# EAGLE schematic Schematic (EAGLE 9.6.2)
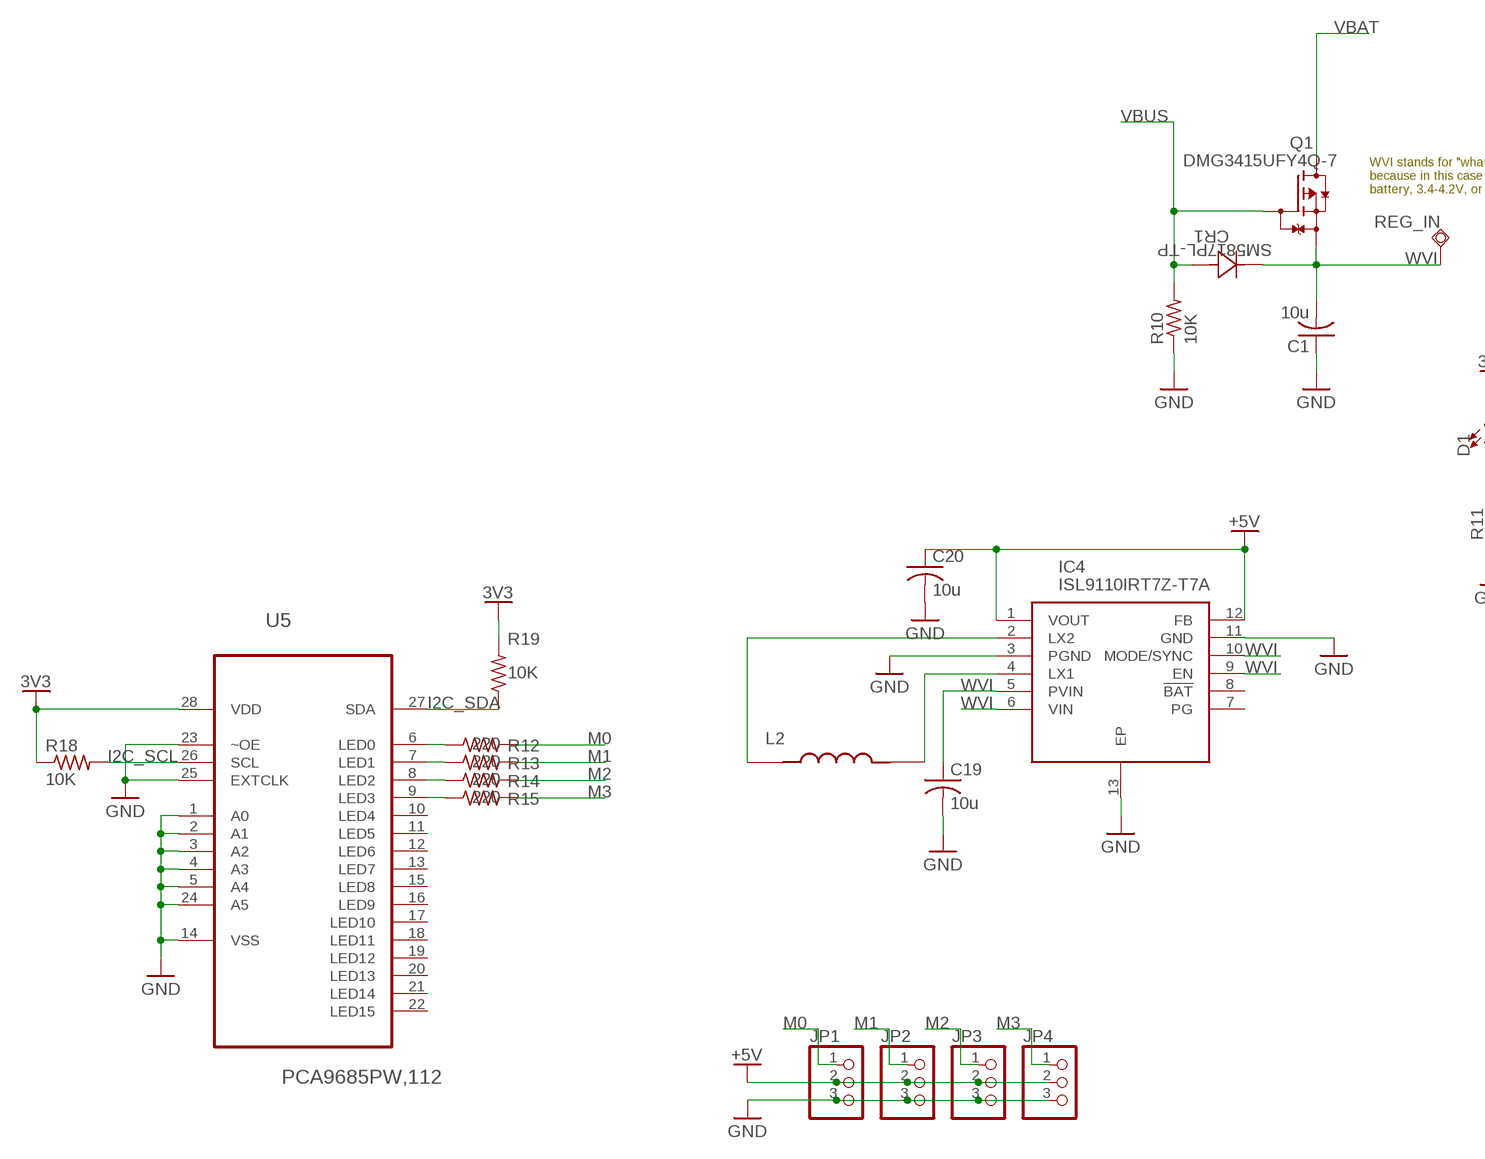
[diagram p0: schematic, sheet 1, part 1 of 2]
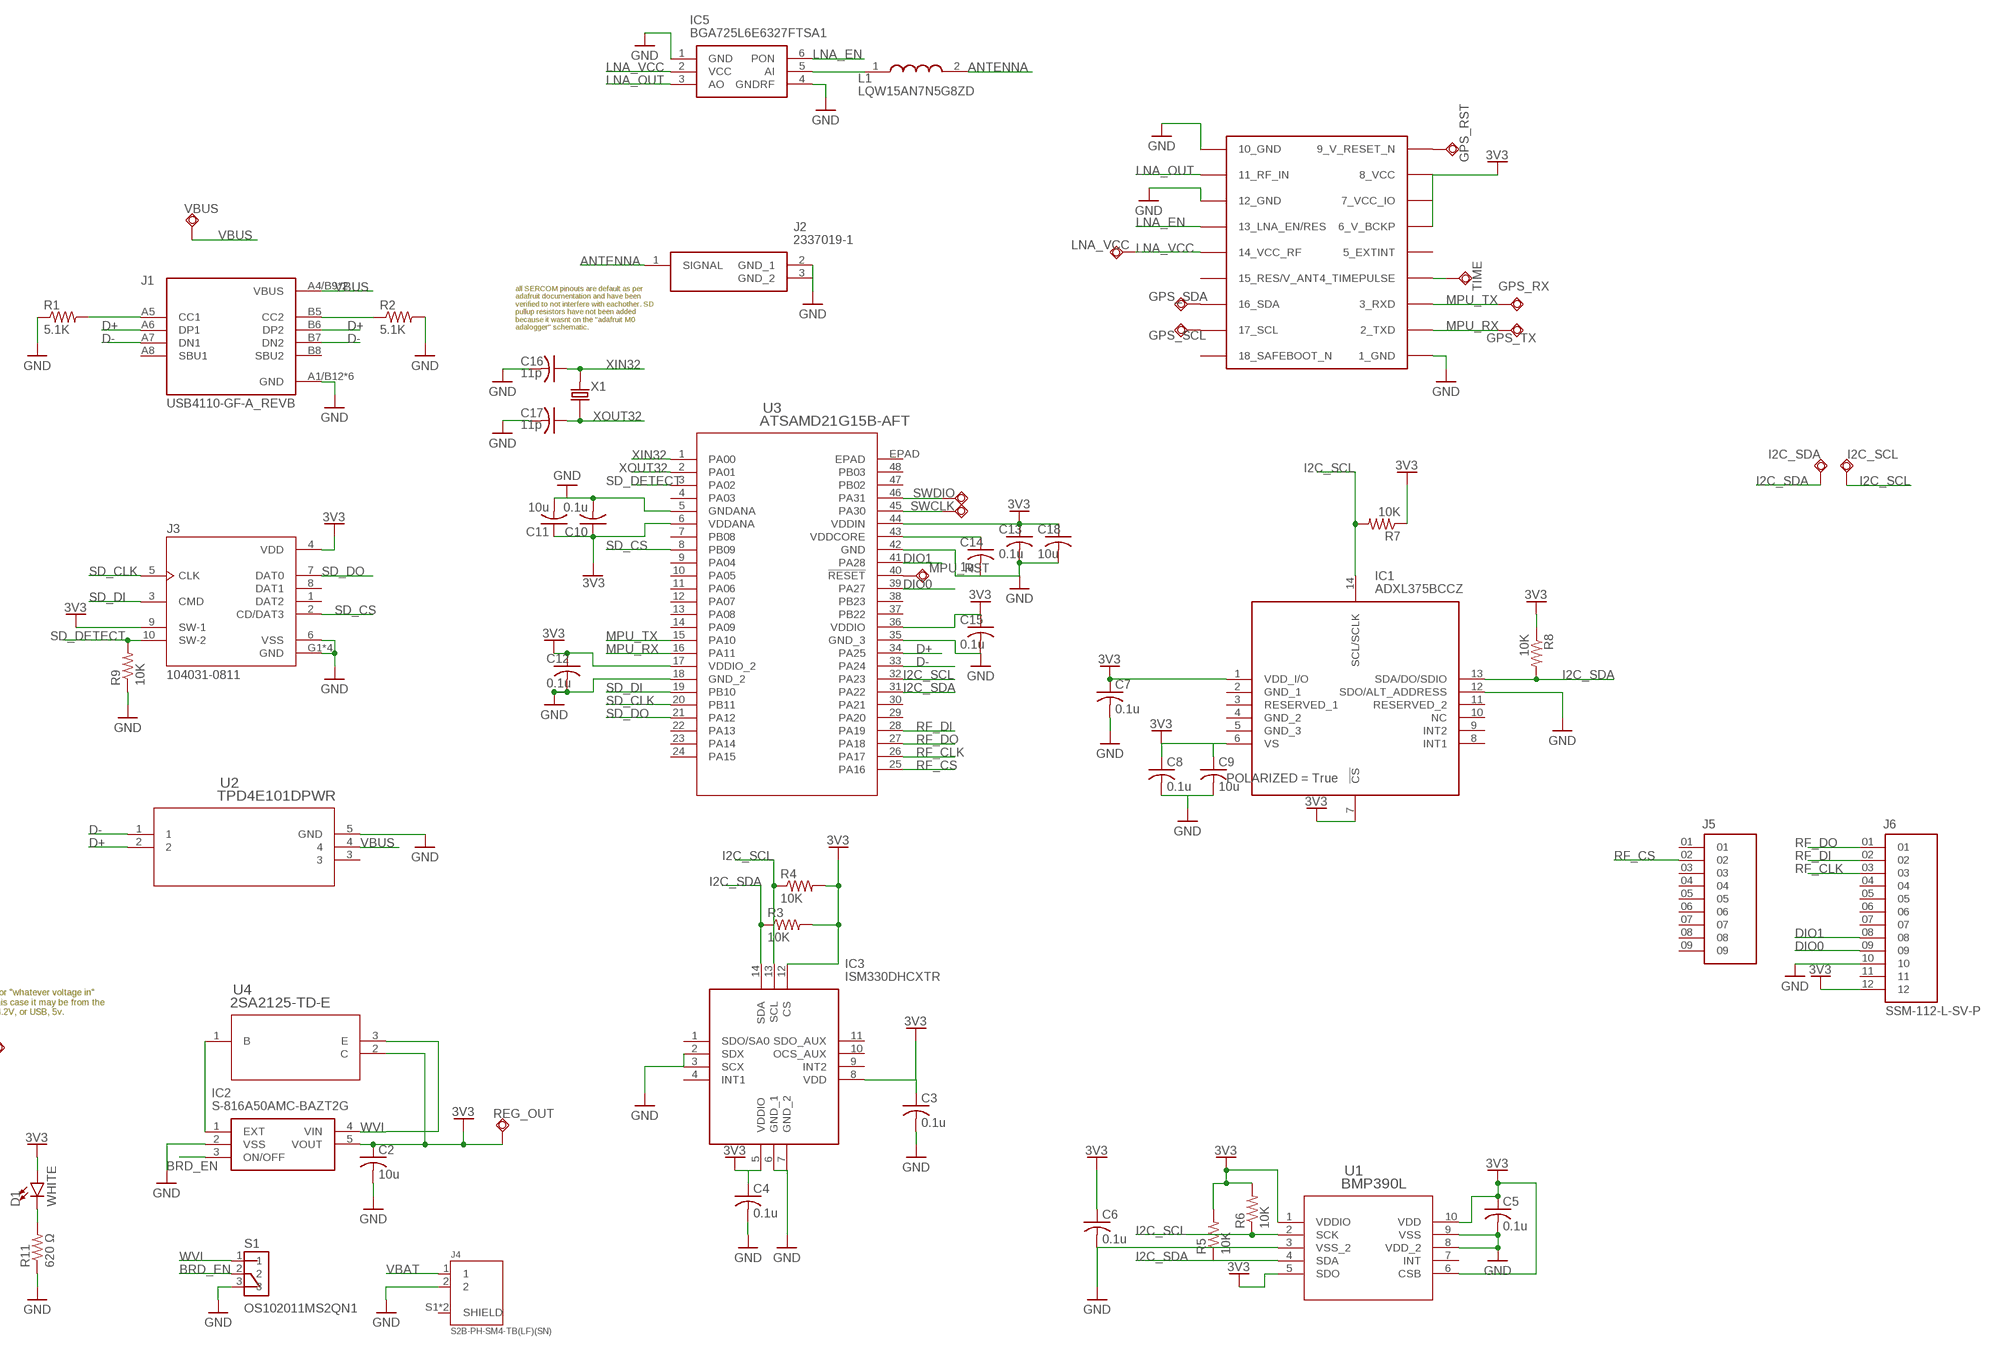
[diagram p1: schematic, sheet 1, part 2 of 2]

## Parts
C1  10u  C-USC0805  [C0805]
C2  10u  C-USC0805  [C0805]
C3  0.1u  C-USC0805  [C0805]
C4  0.1u  C-USC0805  [C0805]
C5  0.1u  C-USC0805  [C0805]
C6  0.1u  C-USC0805  [C0805]
C7  0.1u  C-USC0805  [C0805]
C8  0.1u  C-USC0805  [C0805]
C9  10u  C-USC0805  [C0805]
C10  0.1u  C-USC0603  [C0603]
C11  10u  C-USC0805  [C0805]
C12  0.1u  C-USC0603  [C0603]
C13  0.1u  C-USC0603  [C0603]
C14  1u  C-USC0603  [C0603]
C15  0.1u  C-USC0603  [C0603]
C16  11p  C-US_CHIP-0402(1005-METRIC)  [CAPC1005X60]
C17  11p  C-US_CHIP-0402(1005-METRIC)  [CAPC1005X60]
C18  10u  C-USC0603  [C0603]
C19  10u  C-USC0805K  [C0805K]
C20  10u  C-USC0805K  [C0805K]
CR1  SM5817PL-TP  [CR_5817PL-TP_MCC]
D1  WHITE  LED-WHITE0603  [LED-0603]
GPS_RST  TPSQTP20SQ  [TP20SQ]
GPS_RX  TPSQTP20SQ  [TP20SQ]
GPS_SCL  TPSQTP20SQ  [TP20SQ]
GPS_SDA  TPSQTP20SQ  [TP20SQ]
GPS_TX  TPSQTP20SQ  [TP20SQ]
I2C_SCL  TPSQTP20SQ  [TP20SQ]
I2C_SDA  TPSQTP20SQ  [TP20SQ]
IC1  ADXL375BCCZ  [CC-14-1]
IC2  S-816A50AMC-BAZT2G  [SOT95P275X130-5N]
IC3  ISM330DHCXTR  [LGA-14(2.5X3X0.86)]
IC4  ISL9110IRT7Z-T7A  [SON40P300X300X75-13N]
IC5  BGA725L6E6327FTSA1  [BGS12SN6E6327XTSA1]
J1  USB4110-GF-A_REVB  [GCT_USB4110-GF-A_REVB]
J2  2337019-1  [23370191]
J3  104031-0811  [MOLEX_104031-0811]
J4  S2B-PH-SM4-TB(LF)(SN)  [JST_S2B-PH-SM4-TB(LF)(SN)]
J5  SSM-109-L-SV  [SAMTEC_SSM-109-L-SV]
J6  SSM-112-L-SV-P  [SAMTEC_SSM-112-L-SV-P]
JP1  PINHD-1X3  [1X03]
JP2  PINHD-1X3  [1X03]
JP3  PINHD-1X3  [1X03]
JP4  PINHD-1X3  [1X03]
L1  LQW15AN7N5G8ZD  [LQW15CNR20J00B]
L2  LQH43PN2R2M26L  [IND_LQH43PN2R2M26L]
LNA_VCC  TPSQTP20SQ  [TP20SQ]
MPU_RST  TPSQTP20SQ  [TP20SQ]
Q1  DMG3415UFY4Q-7  [TRANS_DMG3415UFY4Q-7]
R1  5.1K  R-US_M0805  [M0805]
R2  5.1K  R-US_M0805  [M0805]
R3  10K  R-US_M0805  [M0805]
R4  10K  R-US_M0805  [M0805]
R5  10K  R-US_M0805  [M0805]
R6  10K  R-US_M0805  [M0805]
R7  10K  R-US_M0805  [M0805]
R8  10K  R-US_M0805  [M0805]
R9  10K  R-US_M0805  [M0805]
R10  10K  R-US_M0805  [M0805]
R11  620 Ω  R-US_R0402  [R0402]
R12  220  R-US_R0805  [R0805]
R13  220  R-US_R0805  [R0805]
R14  220  R-US_R0805  [R0805]
R15  220  R-US_R0805  [R0805]
R18  10K  R-US_R0805  [R0805]
R19  10K  R-US_R0805  [R0805]
REG_IN  TPSQTP20SQ  [TP20SQ]
REG_OUT  TPSQTP20SQ  [TP20SQ]
S1  OS102011MS2QN1  [SW_OS102011MS2QN1]
SWCLK  TPSQTP20SQ  [TP20SQ]
SWDIO  TPSQTP20SQ  [TP20SQ]
TIME  TPSQTP20SQ  [TP20SQ]
U1  BMP390L  [BMP390L_BOS]
U2  TPD4E101DPWR  [DPW4]
U3  ATSAMD21G15B-AFT  [TQFP48_7X7MC_MCH]
U4  2SA2125-TD-E  [PCP-3_2P5X4P5_ONS]
U5  PCA9685PW,112  [SOP65P640X110-28N]
U$1  MAX-M8  [MAX-M8]
VBUS  TPSQTP20SQ  [TP20SQ]
X1  ECS-.327-7-34B-TR  [XTAL_ECS-.327-7-34B-TR]

## Nets
3V3: C2.1 C3.1 C4.1 C5.1 C6.1 C7.1 C8.1 C9.1 C10.1 C11.1 C12.1 C13.1 C15.1 C18.1 D1.A IC1.1(VDD_I/O) IC1.6(VS) IC1.7(!CS) IC2.5(VOUT) IC3.5(VDDIO) IC3.8(VDD) IC3.12(CS) J3.4(VDD) J3.9(SW-1) J6.12 R3.2 R4.2 R5.2 R6.2 R7.1 R8.1 R18.1 R19.2 REG_OUT.TP U1.1(VDDIO) U1.5(SDO) U1.6(CSB) U1.10(VDD) U3.6(VDDANA) U3.17(VDDIO_2) U3.36(VDDIO) U3.44(VDDIN) U4.2(C) U5.28(VDD) U$1.6_V_BCKP U$1.7_VCC_IO U$1.8_VCC
+5V: C20.1 IC4.1(VOUT) IC4.12(FB) JP1.2 JP2.2 JP3.2 JP4.2
ANTENNA: J2.1(SIGNAL) L1.2
BRD_EN: IC2.3(ON/OFF) S1.2
D+: J1.A6(DP1) J1.B6(DP2) U2.2 U3.34(PA25)
D-: J1.A7(DN1) J1.B7(DN2) U2.1 U3.33(PA24)
DIO0: J6.09 U3.39(PA27)
DIO1: J6.08 U3.41(PA28)
GND: C1.1 C2.2 C3.2 C4.2 C5.2 C6.2 C7.2 C8.2 C9.2 C10.2 C11.2 C12.2 C13.2 C14.2 C15.2 C16.2 C17.2 C18.2 C19.2 C20.2 IC1.12(SDO/ALT_ADDRESS) IC2.2(VSS) IC3.2(SDX) IC3.3(SCX) IC3.6(GND_1) IC3.7(GND_2) IC4.3(PGND) IC4.11(GND) IC4.13(EP) IC5.1(GND) IC5.4(GNDRF) J1.A1/B12(GND) J1.B1/A12(GND) J1.S1(GND) J1.S2(GND) J1.S3(GND) J1.S4(GND) J2.2(GND_1) J2.3(GND_2) J3.6(VSS) J3.G1(GND) J3.G2(GND) J3.G3(GND) J3.G4(GND) J4.2 J6.10 JP1.3 JP2.3 JP3.3 JP4.3 R1.1 R2.2 R9.1 R10.1 R11.1 S1.3 U1.3(VSS_2) U1.8(VDD_2) U1.9(VSS) U2.5(GND) U3.5(GNDANA) U3.18(GND_2) U3.35(GND_3) U3.42(GND) U5.1(A0) U5.2(A1) U5.3(A2) U5.4(A3) U5.5(A4) U5.14(VSS) U5.23(~OE) U5.24(A5) U5.25(EXTCLK) U$1.1_GND U$1.10_GND U$1.12_GND
I2C_SCL: I2C_SCL.TP IC1.14(SCL/SCLK) IC3.13(SCL) R4.1 R6.1 R7.2 R18.2 U1.2(SCK) U3.32(PA23) U5.26(SCL)
I2C_SDA: I2C_SDA.TP IC1.13(SDA/DO/SDIO) IC3.14(SDA) R3.1 R5.1 R8.2 R19.1 U1.4(SDA) U3.31(PA22) U5.27(SDA)
LNA_EN: IC5.6(PON) U$1.13_LNA_EN(13_LNA_EN/RES)
LNA_OUT: IC5.3(AO) U$1.11_RF_IN
LNA_VCC: IC5.2(VCC) LNA_VCC.TP U$1.14_VCC_RF
M0: JP1.1 R12.2
M1: JP2.1 R13.2
M2: JP3.1 R14.2
M3: JP4.1 R15.2
MPU_RX: GPS_TX.TP U3.16(PA11) U$1.2_TXD
MPU_TX: GPS_RX.TP U3.15(PA10) U$1.3_RXD
N$1: J1.A5(CC1) R1.2
N$2: J1.B5(CC2) R2.1
N$3: MPU_RST.TP U3.40(!RESET)
N$4: IC5.5(AI) L1.1
N$5: TIME.TP U$1.4_TIMEPULSE
N$6: C14.1 U3.43(VDDCORE)
N$7: GPS_RST.TP U$1.9_RESET_N(9_V_RESET_N)
N$8: IC2.1(EXT) U4.1(B)
N$9: GPS_SDA.TP U$1.16_SDA
N$10: GPS_SCL.TP U$1.17_SCL
N$11: SWCLK.TP U3.45(PA30)
N$12: SWDIO.TP U3.46(PA31)
N$13: D1.C R11.2
N$14: IC4.4(LX1) L2.2
N$15: IC4.2(LX2) L2.1
N$16: R12.1 U5.6(LED0)
N$17: R13.1 U5.7(LED1)
N$18: R14.1 U5.8(LED2)
N$19: R15.1 U5.9(LED3)
RF_CLK: J6.03 U3.26(PA17)
RF_CS: J5.02 U3.25(PA16)
RF_DI: J6.02 U3.28(PA19)
RF_DO: J6.01 U3.27(PA18)
SD_CLK: J3.5(CLK) U3.20(PB11)
SD_CS: J3.2(CD/DAT3) U3.8(PB09)
SD_DETECT: J3.10(SW-2) R9.2 U3.3(PA02)
SD_DI: J3.3(CMD) U3.19(PB10)
SD_DO: J3.7(DAT0) U3.21(PA12)
VBAT: J4.1 Q1.3(D)
VBUS: CR1.2 J1.A4/B9(VBUS) J1.B4/A9(VBUS) Q1.1(G) R10.2 U2.4 VBUS.TP
WVI: C1.2 C19.1 CR1.1 IC2.4(VIN) IC4.5(PVIN) IC4.6(VIN) IC4.9(EN) IC4.10(MODE/SYNC) Q1.2(S) REG_IN.TP S1.1 U4.3(E)
XIN32: C16.1 U3.1(PA00) X1.2
XOUT32: C17.1 U3.2(PA01) X1.1
Unconnected: IC1.2(GND_1) IC1.3(RESERVED_1) IC1.4(GND_2) IC1.5(GND_3) IC1.8(INT1) IC1.9(INT2) IC1.10(NC) IC1.11(RESERVED_2) IC3.1(SDO/SA0) IC3.4(INT1) IC3.9(INT2) IC3.10(OCS_AUX) IC3.11(SDO_AUX) IC4.7(PG) IC4.8(!BAT) J1.A8(SBU1) J1.B8(SBU2) J3.1(DAT2) J3.8(DAT1) J4.S1(SHIELD) J4.S2(SHIELD) J5.01 J5.03 J5.04 J5.05 J5.06 J5.07 J5.08 J5.09 J6.04 J6.05 J6.06 J6.07 J6.11 U1.7(INT) U2.3 U3.4(PA03) U3.7(PB08) U3.9(PA04) U3.10(PA05) U3.11(PA06) U3.12(PA07) U3.13(PA08) U3.14(PA09) U3.22(PA13) U3.23(PA14) U3.24(PA15) U3.29(PA20) U3.30(PA21) U3.37(PB22) U3.38(PB23) U3.47(PB02) U3.48(PB03) U3.EPAD U5.10(LED4) U5.11(LED5) U5.12(LED6) U5.13(LED7) U5.15(LED8) U5.16(LED9) U5.17(LED10) U5.18(LED11) U5.19(LED12) U5.20(LED13) U5.21(LED14) U5.22(LED15) U$1.5_EXTINT U$1.15_V_ANT/RESERVED(15_RES/V_ANT) U$1.18_SAFEBOOT_N

## Notes on the sheet
- all SERCOM pinouts are default as per 
  adafruit documentation and have been 
  verified to not interfere with eachother. SD 
  pullup resistors have not been added 
  because it wasnt on the "adafruit M0 
  adalogger" schematic.
- WVI stands for "whatever voltage in"
  because in this case it may be from the 
  battery, 3.4-4.2V, or USB, 5v.

## Library data of the parts
C1-C8 C10-C15 C18-C20 = resistor:C-US: CAPACITOR, American symbol
C9 = resistor:C-US: CAPACITOR, American symbol; POLARIZED: True
C16 C17 = Capacitor:C-US: Capacitor - ANSI; CATEGORY: Capacitor
CR1 = SM5817PL-TP:SM5817PL-TP; COPYRIGHT: Copyright (C) 2022 Ultra Librarian. All rights reserved.; DIGI-KEY_PART_NUMBER_1: SM5817PL-TPMSTR-ND; DIGI-KEY_PART_NUMBER_2: SM5817PL-TPMSCT-ND; DIGI-KEY_PART_NUMBER_3: SM5817PL-TPMSDKR-ND; MANUFACTURER_PART_NUMBER: SM5817PL-TP; MFR_NAME: MCC
D1 = SparkFun-LED:LED-WHITE: White SMD LED Used in manufacturing several products at SparkFun. Packages: 0603 - Bright White SMD 0603 package[Product Link] <http://www.kingbrightusa.com/product.asp?catalog_name=LED&product_id=APT1608QWF/D> 1206 - Bright White SMD1206 package [Product Link] <http://www.kingbrightusa.com/product.asp?catalog_name=LED&product_id=APT3216QWF/D> 3014 - Super Bright SMD 3014 package [Datasheet] <http://www.lumileds.com/uploads/459/DS208-pdf> SparkFun Products: Blackberry Trackballer Breakout <https://www.sparkfun.com/products/13169> Digital SandBox <https://www.sparkfun.com/products/12651>; PROD_ID: DIO-09004
GPS_RST GPS_RX GPS_SCL GPS_SDA GPS_TX I2C_SCL I2C_SDA LNA_VCC MPU_RST REG_IN REG_OUT SWCLK SWDIO TIME VBUS = testpad:TPSQ: Test pad
IC1 = ADXL375BCCZ:ADXL375BCCZ: ADXL375BCCZ Analog Devices, 3-Axis Accelerometer, I2C, Serial-3 Wire, Serial-4 Wire, Serial-SPI, 14-Pin LGA Source: Datasheet; DESCRIPTION: ADXL375BCCZ Analog Devices, 3-Axis Accelerometer, I2C, Serial-3 Wire, Serial-4 Wire, Serial-SPI, 14-Pin LGA; HEIGHT: mm; MANUFACTURER_NAME: Analog Devices; MANUFACTURER_PART_NUMBER: ADXL375BCCZ; MOUSER_PART_NUMBER: 584-ADXL375BCCZ; MOUSER_PRICE-STOCK: https://www.mouser.co.uk/ProductDetail/Analog-Devices/ADXL375BCCZ?qs=S4ILP0tmc7Q%2Fd%2FHPWf9YpQ%3D%3D
IC2 = S-816A50AMC-BAZT2G:S-816A50AMC-BAZT2G: IC REG LINEAR 5V 1A SOT23-5 Source: Datasheet <https://componentsearchengine.com/Datasheets/1/S-816A50AMC-BAZT2G.pdf>; DESCRIPTION: IC REG LINEAR 5V 1A SOT23-5; HEIGHT: 1.3mm; MANUFACTURER_NAME: ABLIC Inc.; MANUFACTURER_PART_NUMBER: S-816A50AMC-BAZT2G; MOUSER_PART_NUMBER: 628-S-816A50AMC-BAZG; MOUSER_PRICE-STOCK: https://www.mouser.com/Search/Refine.aspx?Keyword=628-S-816A50AMC-BAZG
IC3 = ISM330DHCXTR:ISM330DHCXTR: IMUs - Inertial Measurement Units VFLGA2.5X3X.86 14L P.5 L.475X.25 Source: Datasheet <https://www.st.com/resource/en/datasheet/ism330dhcx.pdf>; DESCRIPTION: IMUs - Inertial Measurement Units VFLGA2.5X3X.86 14L P.5 L.475X.25; HEIGHT: mm; MANUFACTURER_NAME: STMicroelectronics; MANUFACTURER_PART_NUMBER: ISM330DHCXTR; MOUSER_PART_NUMBER: 511-ISM330DHCXTR; MOUSER_PRICE-STOCK: https://www.mouser.co.uk/ProductDetail/STMicroelectronics/ISM330DHCXTR?qs=%252B6g0mu59x7Jv2Xps2dM6Xw%3D%3D
IC4 = ISL9110IRT7Z-T7A:ISL9110IRT7Z-T7A: Switching Voltage Regulators 1 2A SINGLE IND BUCK BOOST 3 3V 12LD Source: Datasheet <https://datasheet.datasheetarchive.com/originals/distributors/Datasheets-SFU4/DSASF4000-1643.pdf>; DESCRIPTION: Switching Voltage Regulators 1 2A SINGLE IND BUCK BOOST 3 3V 12LD; HEIGHT: 0.75mm; MANUFACTURER_NAME: Renesas Electronics; MANUFACTURER_PART_NUMBER: ISL9110IRT7Z-T7A; MOUSER_PART_NUMBER: 968-ISL9110IRT7Z-T7A; MOUSER_PRICE-STOCK: https://www.mouser.co.uk/ProductDetail/Renesas-Intersil/ISL9110IRT7Z-T7A?qs=dAsayXGOMrujtMdmCjK0tg%3D%3D
IC5 = BGA725L6E6327FTSA1:BGA725L6E6327FTSA1: INFINEON - BGA725L6E6327FTSA1 - RF AMP, 20DB, 1.615GHZ, 3.6V, TSLP-6 Source: Datasheet <https://www.infineon.com/dgdl/Infineon-BGA725L6-DS-v02_00-en.pdf?fileId=db3a30433784a0400137ef9a4d341f23>; DESCRIPTION: INFINEON - BGA725L6E6327FTSA1 - RF AMP, 20DB, 1.615GHZ, 3.6V, TSLP-6; HEIGHT: mm; MANUFACTURER_NAME: Infineon; MANUFACTURER_PART_NUMBER: BGA725L6E6327FTSA1; MOUSER_PART_NUMBER: 726-BGA725L6E6327FTS; MOUSER_PRICE-STOCK: https://www.mouser.co.uk/ProductDetail/Infineon-Technologies/BGA725L6E6327FTSA1?qs=4MqXaUMeF57lT69yR2PUGQ%3D%3D
J1 = USB4110-GF-A_REVB:USB4110-GF-A_REVB; DESCRIPTION: USB-C (USB TYPE-C) USB 2.0 Receptacle Connector 24 (16+8 Dummy) Position Surface Mount, Right Angle; Through Hole; DIGI-KEY_PART_NUMBER: 2073-USB4110-GF-A-2-ND; MF: GCT; MP: USB4110-GF-A; PACKAGE: None; PURCHASE-URL: https://pricing.snapeda.com/search/part/USB4110-GF-A/?ref=eda
J2 = 2337019-1:2337019-1: RF Connectors / Coaxial Connectors MicroCoax receptacle UMCC Gen 1 Source: Datasheet <https://www.te.com/commerce/DocumentDelivery/DDEController?Action=showdoc&DocId=Customer DrawingC-2337019A3pdfEnglishENG_CD_C-2337019_A3.pdf2337019-1>; DESCRIPTION: RF Connectors / Coaxial Connectors MicroCoax receptacle UMCC Gen 1; HEIGHT: 1.4mm; MANUFACTURER_NAME: TE Connectivity; MANUFACTURER_PART_NUMBER: 2337019-1; MOUSER_PART_NUMBER: 571-2337019-1; MOUSER_PRICE-STOCK: https://www.mouser.co.uk/ProductDetail/TE-Connectivity/2337019-1?qs=l4Gc20tDgJIuN7nS9rJkJw%3D%3D
J3 = 104031-0811:104031-0811: 10 (8 + 2) Position Card Connector Secure Digital - microSD™ Surface Mount, Right Angle Gold; DESCRIPTION: 10 (8 + 2) Position Card Connector Secure Digital - microSD™ Surface Mount, Right Angle Gold; DIGI-KEY_PART_NUMBER: WM6357TR-ND; MF: Molex; MP: 1040310811; PACKAGE: None
J4 = S2B-PH-SM4-TB_LF__SN_:S2B-PH-SM4-TB(LF)(SN): PH Series 2 Position 2 mm Pitch Surface Mount Side Entry Shrouded Header; DESCRIPTION: Connector Header Surface Mount, Right Angle 2 position 0.079 (2.00mm); DIGI-KEY_PART_NUMBER: 455-1749-1-ND; MF: JST Sales; MP: S2B-PH-SM4-TB(LF)(SN); PACKAGE: None
J5 = SSM-109-L-SV:SSM-109-L-SV; DESCRIPTION: 9 Position Receptacle, Bottom Entry Connector 0.100 (2.54mm) Surface Mount Gold; DIGI-KEY_PART_NUMBER: 612-SSM-109-L-SV-BE-LC-TR-ND; MF: Samtec; MP: SSM-109-L-SV; PACKAGE: None; PURCHASE-URL: https://pricing.snapeda.com/search/part/SSM-109-L-SV/?ref=eda
J6 = SSM-112-L-SV-P:SSM-112-L-SV-P; DESCRIPTION: 12 Position Receptacle, Pass Through Connector 0.100 (2.54mm) Surface Mount Gold; DIGI-KEY_PART_NUMBER: SSM-112-L-SV-P-TR-ND; MF: Samtec; MP: SSM-112-L-SV-P; PACKAGE: None; PURCHASE-URL: https://pricing.snapeda.com/search/part/SSM-112-L-SV-P/?ref=eda
JP1-JP4 = pinhead:PINHD-1X3: PIN HEADER
L1 = LQW15AN7N5G8ZD:LQW15AN7N5G8ZD: LQW15AN_8Z Series Inductor 7.5nH +/-2% 0402 (1005) Source: Datasheet <https://componentsearchengine.com/Datasheets/1/LQW15AN7N5G8ZD.pdf>; DESCRIPTION: LQW15AN_8Z Series Inductor 7.5nH +/-2% 0402 (1005); HEIGHT: 0.6mm; MANUFACTURER_NAME: Murata Electronics; MANUFACTURER_PART_NUMBER: LQW15AN7N5G8ZD; MOUSER_PART_NUMBER: 81-LQW15AN7N5G8ZD; MOUSER_PRICE-STOCK: https://www.mouser.com/Search/Refine.aspx?Keyword=81-LQW15AN7N5G8ZD
L2 = LQH43PN2R2M26L:LQH43PN2R2M26L: Inductor Power Chip Unshielded Wirewound 10uH 10% 1MHz Ferrite 650mA 240mOhm DCR 1812 T/R; DESCRIPTION: Inductor with Inductance: 2.2uH Tol. +/-20%, Package: 1812 (4532); DIGI-KEY_PART_NUMBER: 490-12049-1-ND; MF: Murata; MP: LQH43PN2R2M26L; PACKAGE: NONSTANDARD; PURCHASE-URL: https://pricing.snapeda.com/search/part/LQH43PN2R2M26L/?ref=eda
Q1 = DMG3415UFY4Q-7:DMG3415UFY4Q-7: Mosfet Bvdss: 8v~24v X2-Dfn2015-3 t&r 3k; DESCRIPTION: P-Channel 16 V 2.5A (Ta) 650mW (Ta) Surface Mount X2-DFN2015-3; DIGI-KEY_PART_NUMBER: DMG3415UFY4Q-7DICT-ND; MF: Diodes Inc.; MP: DMG3415UFY4Q-7; PACKAGE: DFN-2 Diodes Inc.; PURCHASE-URL: https://pricing.snapeda.com/search/part/DMG3415UFY4Q-7/?ref=eda
R1-R15 R18 R19 = resistor:R-US_: RESISTOR, American symbol
S1 = OS102011MS2QN1:OS102011MS2QN1: Switch Slide ON ON SPDT Top Slide 0.1A 12VDC 10000Cycles PC Pins Thru-Hole Bulk; DESCRIPTION: SLIDE SWITCH SPDT T/H ON-ON BBM; DIGI-KEY_PART_NUMBER: CKN12284-ND; MF: C&K; MP: OS102011MS2QN1; PACKAGE: None; PURCHASE-URL: https://pricing.snapeda.com/search/part/OS102011MS2QN1/?ref=eda
U1 = BMP390L:BMP390L; COPYRIGHT: Copyright (C) 2022 Ultra Librarian. All rights reserved.; DIGI-KEY_PART_NUMBER_1: 828-BMP390LTR-ND; DIGI-KEY_PART_NUMBER_2: 828-BMP390LCT-ND; MANUFACTURER_PART_NUMBER: BMP390L; MFR_NAME: Bosch Sensortec
U2 = TPD4E101DPWR:TPD4E101DPWR; COPYRIGHT: Copyright (C) 2021 Ultra Librarian. All rights reserved.; DIGI-KEY_PART_NUMBER_1: 2156-TPD4E101DPWR-ND; DIGI-KEY_PART_NUMBER_2: 296-39345-1-ND; DIGI-KEY_PART_NUMBER_3: 296-39345-2-ND; DIGI-KEY_PART_NUMBER_4: 296-39345-6-ND; DIGI-KEY_PART_NUMBER_5: TPD4E101DPWR-ND; MANUFACTURER_PART_NUMBER: TPD4E101DPWR; MFR_NAME: Texas Instruments
U3 = ATSAMD21G15B-AFT:ATSAMD21G15B-AFT; COPYRIGHT: Copyright (C) 2021 Ultra Librarian. All rights reserved.; DIGI-KEY_PART_NUMBER_1: 1611-ATSAMD21G15B-AFTCT-ND; DIGI-KEY_PART_NUMBER_2: ATSAMD21G15B-AFTCT-ND; DIGI-KEY_PART_NUMBER_3: ATSAMD21G15B-AFTDKR-ND; DIGI-KEY_PART_NUMBER_4: ATSAMD21G15B-AFTTR-ND; MANUFACTURER_PART_NUMBER: ATSAMD21G15B-AFT; MFR_NAME: Microchip
U4 = ‎2SA2125:2SA2125-TD-E; COPYRIGHT: Copyright (C) 2022 Ultra Librarian. All rights reserved.; DIGI-KEY_PART_NUMBER_1: 2SA2125-TD-EOSTR-ND; DIGI-KEY_PART_NUMBER_2: 2SA2125-TD-EOSCT-ND; DIGI-KEY_PART_NUMBER_3: 2SA2125-TD-EOSDKR-ND; MANUFACTURER_PART_NUMBER: 2SA2125-TD-E; MFR_NAME: onsemi
U5 = PCA9685PW_112:PCA9685PW,112: 16-channel, 12-bit PWM Fm+ I2C-bus LED controller; DESCRIPTION: LED Driver IC 16 Output Linear - PWM Dimming 25mA 28-TSSOP; DIGI-KEY_PART_NUMBER: 568-8366-5-ND; MF: NXP USA; MP: PCA9685PW,112; PACKAGE: TSSOP-28 NXP Semiconductors; PURCHASE-URL: https://pricing.snapeda.com/search/part/PCA9685PW,112/?ref=eda
U$1 = ubloxLib:MAX-M8: u-blox MAX GNSS module
X1 = ECS-.327-7-34B-TR:ECS-.327-7-34B-TR: Crystal 2-SMD, No Lead; DESCRIPTION: 32.768 kHz ±20ppm Crystal 7pF 70 kOhms 2-SMD, No Lead; DIGI-KEY_PART_NUMBER: XC1656CT-ND; MF: ECS Inc.; MP: ECS-.327-7-34B-TR; PACKAGE: SMD-2 ECS International; PURCHASE-URL: https://pricing.snapeda.com/search/part/ECS-.327-7-34B-TR/?ref=eda